# Altium project Breakout Board.PrjPcb
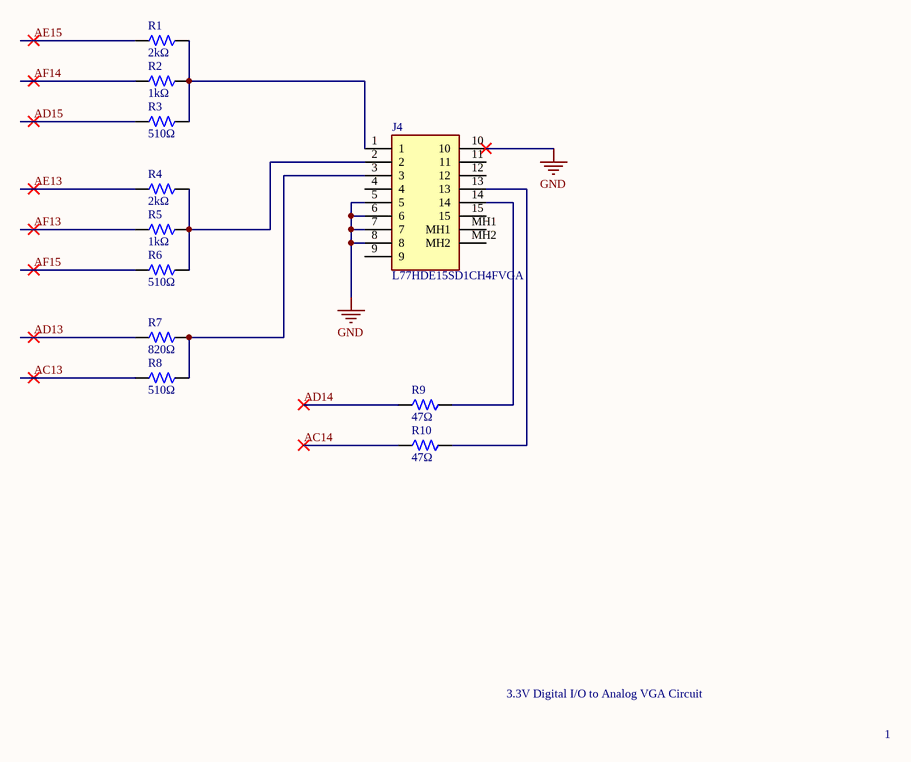
[diagram p0: VGA.SchDoc]
6 sheets, 96 parts. Net scope: flat (ports and power ports of the same name join across sheets).
Board files: PCB1.PcbDoc, revision2.PcbDoc
Sheets:
  VGA.SchDoc
  FPGA_GPIO.SchDoc
  MICROSD.SchDoc
  SWITCHES.SchDoc
  BOARD_GPIO.SchDoc
  HDMI.SchDoc

## Sheet VGA.SchDoc
size A; SheetNumber: 1; SheetTotal: 5

### Parts
J4  L77HDE15SD1CH4FVGA  [L77HDE15SD1CH4FVGA]
R1  Resistance: 2kΩ  [RES-0402]  (hidden comment: 0402WGF2001TCE)
R2  Resistance: 1kΩ  [RES-0402]  (hidden comment: 0402WGF1001TCE)
R3  Resistance: 510Ω  [RES-0402]  (hidden comment: 0402WGF5100TCE)
R4  Resistance: 2kΩ  [RES-0402]  (hidden comment: 0402WGF2001TCE)
R5  Resistance: 1kΩ  [RES-0402]  (hidden comment: 0402WGF1001TCE)
R6  Resistance: 510Ω  [RES-0402]  (hidden comment: 0402WGF5100TCE)
R7  Resistance: 820Ω  [RES-0603]  (hidden comment: 0603WAF8200T5E)
R8  Resistance: 510Ω  [RES-0402]  (hidden comment: 0402WGF5100TCE)
R9  Resistance: 47Ω  [RES-0603]  (hidden comment: 0603WAF470JT5E)
R10  Resistance: 47Ω  [RES-0603]  (hidden comment: 0603WAF470JT5E)

### Nets
GND: J4.5 J4.6 J4.7 J4.8 J4.10  [project net DDCSDA]
AC13: R8.1
AC14: R10.1
AD13: R7.1
AD14: R9.1
AD15: R3.1
AE13: R4.1
AE15: R1.1
AF13: R5.1
AF14: R2.1
AF15: R6.1
NetJ4_1: J4.1 R1.2 R2.2 R3.2
NetJ4_2: J4.2 R4.2 R5.2 R6.2
NetJ4_3: J4.3 R7.2 R8.2
NetJ4_13: J4.13 R10.2
NetJ4_14: J4.14 R9.2

Not connected (* = marked no-connect by the designer): J4 4 9 11 12 15 MH1 MH2

### Notes on the sheet
- 3.3V Digital I/O to Analog VGA Circuit
- 1

### Library data of the parts
J4 = L77HDE15SD1CH4FVGA: Connector; Manufacturer_Name: Amphenol Communications Solutions; Datasheet Link: https://cdn.amphenol-cs.com/media/wysiwyg/files/drawing/l77hde15sd1ch4fvga.pdf; Height: 12.85mm; Manufacturer_Part_Number: L77HDE15SD1CH4FVGA; Mouser Part Number: 523-7HDE15SD1CH4FVGA; Mouser Price/Stock: https://www.mouser.co.uk/ProductDetail/Amphenol-Commercial-Products/L77HDE15SD1CH4FVGA?qs=ToP8pWlZ0bNtQSp9f8k5Rw%3D%3D; Arrow Part Number: L77HDE15SD1CH4FVGA; Arrow Price/Stock: https://www.arrow.com/en/products/l77hde15sd1ch4fvga/amphenol-fci?region=nac
R1 R4 = 0402WGF2001TCE: Resistor, 2kΩ, ±1%, 62.5mW, 50V, ±100ppm/℃, -55℃~+155℃, SMD 0402; Manufacturer: Uniroyal; Supplier 1: LCSC; Manufacturer Part Number: 0402WGF2001TCE; Supplier Part Number 1: C4109; JLCPCB Part Number: C4109; Power Rating: 62.5mW; Category: Resistors; Package Size: 0402; JLCPCB Basic Part: Yes; Tolerance: ±1%; Voltage Rating: 50V; Temperature Coefficient: ±100ppm/℃; Temperature Rating: -55℃~+155℃; ComponentLink1Description: Datasheet; ComponentLink1URL: https://wmsc.lcsc.com/wmsc/upload/file/pdf/v2/lcsc/2206010230_UNI-ROYAL-Uniroyal-Elec-0402WGF2001TCE_C4109.pdf; ComponentLink2Description: JLCPCB Part URL; ComponentLink2URL: https://jlcpcb.com/partdetail/C4109
R2 R5 = 0402WGF1001TCE: Resistor, 1kΩ, ±1%, 62.5mW, 50V, ±100ppm/℃, -55℃~+155℃, SMD 0402; Manufacturer: Uniroyal; Supplier 1: LCSC; Manufacturer Part Number: 0402WGF1001TCE; Supplier Part Number 1: C11702; JLCPCB Part Number: C11702; Power Rating: 62.5mW; Category: Resistors; Package Size: 0402; JLCPCB Basic Part: Yes; Tolerance: ±1%; Voltage Rating: 50V; Temperature Coefficient: ±100ppm/℃; Temperature Rating: -55℃~+155℃; ComponentLink1Description: Datasheet; ComponentLink1URL: https://wmsc.lcsc.com/wmsc/upload/file/pdf/v2/lcsc/2206010216_UNI-ROYAL-Uniroyal-Elec-0402WGF1001TCE_C11702.pdf; ComponentLink2Description: JLCPCB Part URL; ComponentLink2URL: https://jlcpcb.com/partdetail/C11702
R3 R6 R8 = 0402WGF5100TCE: Resistor, 510Ω, ±1%, 62.5mW, 50V, ±100ppm/℃, -55℃~+155℃, SMD 0402; Manufacturer: Uniroyal; Supplier 1: LCSC; Manufacturer Part Number: 0402WGF5100TCE; Supplier Part Number 1: C25123; JLCPCB Part Number: C25123; Power Rating: 62.5mW; Category: Resistors; Package Size: 0402; JLCPCB Basic Part: Yes; Tolerance: ±1%; Voltage Rating: 50V; Temperature Coefficient: ±100ppm/℃; Temperature Rating: -55℃~+155℃; ComponentLink1Description: Datasheet; ComponentLink1URL: https://wmsc.lcsc.com/wmsc/upload/file/pdf/v2/lcsc/2205311900_UNI-ROYAL-Uniroyal-Elec-0402WGF5100TCE_C25123.pdf; ComponentLink2Description: JLCPCB Part URL; ComponentLink2URL: https://jlcpcb.com/partdetail/C25123
R7 = 0603WAF8200T5E: Resistor, 820Ω, ±1%, 100mW, 75V, ±100ppm/℃, -55℃~+155℃, SMD 0603; Manufacturer: Uniroyal; Supplier 1: LCSC; Manufacturer Part Number: 0603WAF8200T5E; Supplier Part Number 1: C23253; JLCPCB Part Number: C23253; Power Rating: 100mW; Category: Resistors; Package Size: 0603; JLCPCB Basic Part: Yes; Tolerance: ±1%; Voltage Rating: 75V; Temperature Coefficient: ±100ppm/℃; Temperature Rating: -55℃~+155℃; ComponentLink1Description: Datasheet; ComponentLink1URL: https://wmsc.lcsc.com/wmsc/upload/file/pdf/v2/lcsc/2206010100_UNI-ROYAL-Uniroyal-Elec-0603WAF8200T5E_C23253.pdf; ComponentLink2Description: JLCPCB Part URL; ComponentLink2URL: https://jlcpcb.com/partdetail/C23253
R9 R10 = 0603WAF470JT5E: Resistor, 47Ω, ±1%, 100mW, 75V, ±100ppm/℃, -55℃~+155℃, SMD 0603; Manufacturer: Uniroyal; Supplier 1: LCSC; Manufacturer Part Number: 0603WAF470JT5E; Supplier Part Number 1: C23182; JLCPCB Part Number: C23182; Power Rating: 100mW; Category: Resistors; Package Size: 0603; JLCPCB Basic Part: Yes; Tolerance: ±1%; Voltage Rating: 75V; Temperature Coefficient: ±100ppm/℃; Temperature Rating: -55℃~+155℃; ComponentLink1Description: Datasheet; ComponentLink1URL: https://wmsc.lcsc.com/wmsc/upload/file/pdf/v2/lcsc/2206010116_UNI-ROYAL-Uniroyal-Elec-0603WAF470JT5E_C23182.pdf; ComponentLink2Description: JLCPCB Part URL; ComponentLink2URL: https://jlcpcb.com/partdetail/C23182

## Sheet FPGA_GPIO.SchDoc
size A; SheetNumber: 2; SheetTotal: 5; Application_BuildNumber: 1
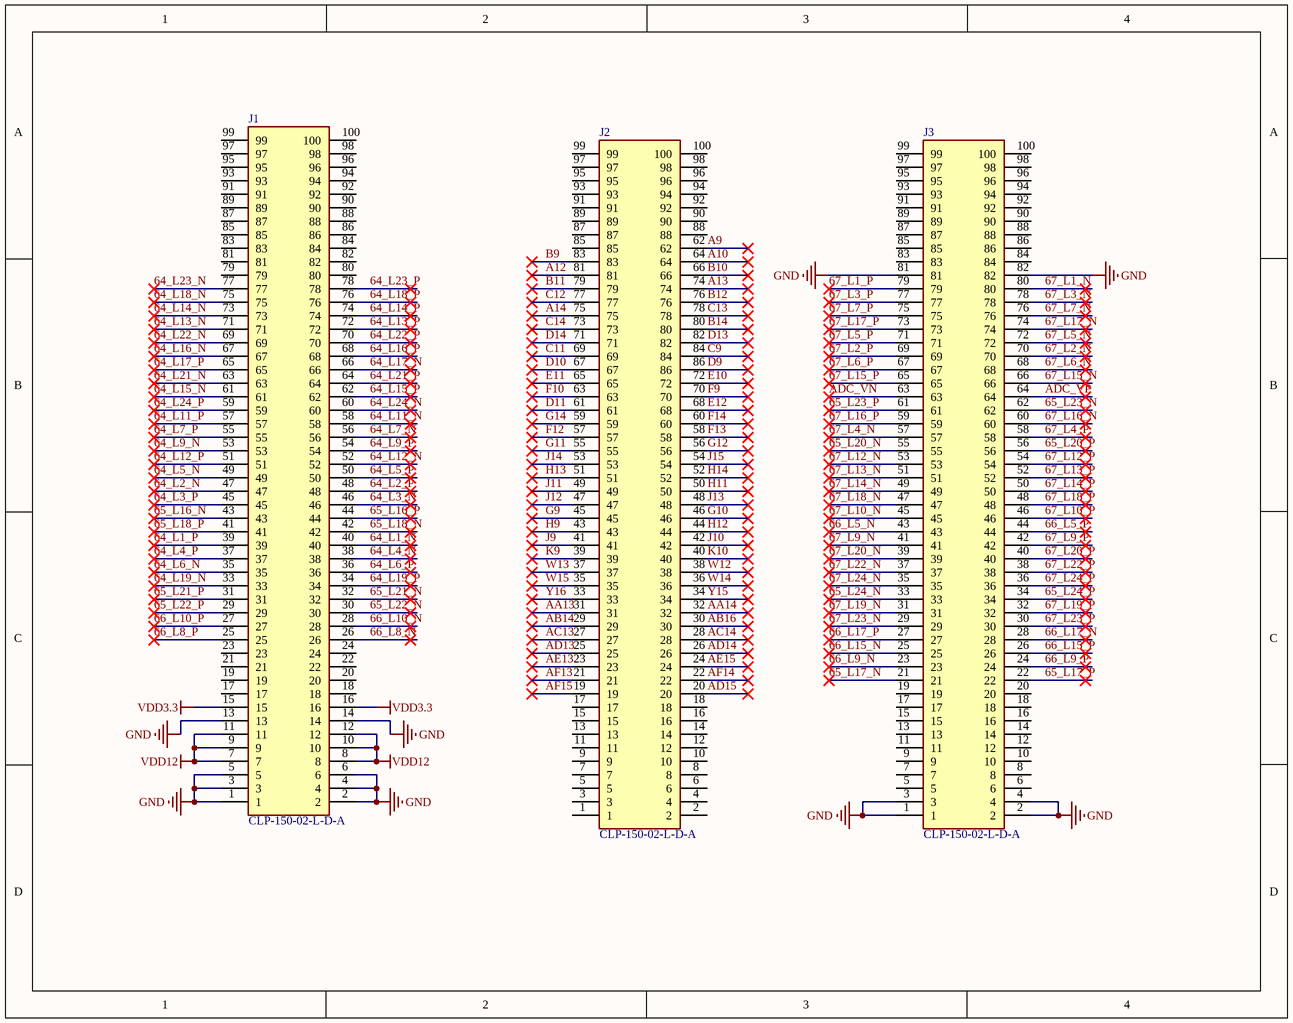
[diagram p1: FPGA_GPIO.SchDoc]

### Parts
J1  CLP-150-02-L-D-A  [CLP-150-02-XXX-D-A]  (no BOM)
J2  CLP-150-02-L-D-A  [CLP-150-02-XXX-D-A]  (no BOM)
J3  CLP-150-02-L-D-A  [CLP-150-02-XXX-D-A]  (no BOM)

### Nets
GND: J1.1 J1.2 J1.3 J1.4 J1.5 J1.6 J1.13 J1.14 J3.1 J3.2 J3.3 J3.4 J3.81 J3.82  [project net DDCSDA]
VDD3.3: J1.15 J1.16
VDD12: J1.7 J1.8 J1.9 J1.10 J1.11 J1.12
64_L1_N: J1.40
64_L1_P: J1.39
64_L2_N: J1.47
64_L2_P: J1.48
64_L3_N: J1.46
64_L3_P: J1.45
64_L4_N: J1.38
64_L4_P: J1.37
64_L5_N: J1.49
64_L5_P: J1.50
64_L6_N: J1.35
64_L6_P: J1.36
64_L7_N: J1.56
64_L7_P: J1.55
64_L9_N: J1.53
64_L9_P: J1.54
64_L11_N: J1.58
64_L11_P: J1.57
64_L12_N: J1.52
64_L12_P: J1.51
64_L13_N: J1.71
64_L13_P: J1.72
64_L14_N: J1.73
64_L14_P: J1.74
64_L15_N: J1.61
64_L15_P: J1.62
64_L16_N: J1.67
64_L16_P: J1.68
64_L17_N: J1.66
64_L17_P: J1.65
64_L18_N: J1.75
64_L18_P: J1.76
64_L19_N: J1.33
64_L19_P: J1.34
64_L21_N: J1.63
64_L21_P: J1.64
64_L22_N: J1.69
64_L22_P: J1.70
64_L23_N: J1.77
64_L23_P: J1.78
64_L24_N: J1.60
64_L24_P: J1.59
65_L16_N: J1.43
65_L16_P: J1.44
65_L17_N: J3.21
65_L17_P: J3.22
65_L18_N: J1.42
65_L18_P: J1.41
65_L20_N: J3.55
65_L20_P: J3.56
65_L21_N: J1.32
65_L21_P: J1.31
65_L22_N: J1.30
65_L22_P: J1.29
65_L23_N: J3.62
65_L23_P: J3.61
65_L24_N: J3.33
65_L24_P: J3.34
66_L5_N: J3.43
66_L5_P: J3.44
66_L8_N: J1.26
66_L8_P: J1.25
66_L9_N: J3.23
66_L9_P: J3.24
66_L10_N: J1.28
66_L10_P: J1.27
66_L15_N: J3.25
66_L15_P: J3.26
66_L17_N: J3.28
66_L17_P: J3.27
67_L1_N: J3.80
67_L1_P: J3.79
67_L2_N: J3.70
67_L2_P: J3.69
67_L3_N: J3.78
67_L3_P: J3.77
67_L4_N: J3.57
67_L4_P: J3.58
67_L5_N: J3.72
67_L5_P: J3.71
67_L6_N: J3.68
67_L6_P: J3.67
67_L7_N: J3.76
67_L7_P: J3.75
67_L9_N: J3.41
67_L9_P: J3.42
67_L10_N: J3.45
67_L10_P: J3.46
67_L12_N: J3.53
67_L12_P: J3.54
67_L13_N: J3.51
67_L13_P: J3.52
67_L14_N: J3.49
67_L14_P: J3.50
67_L15_N: J3.66
67_L15_P: J3.65
67_L16_N: J3.60
67_L16_P: J3.59
67_L17_N: J3.74
67_L17_P: J3.73
67_L18_N: J3.47
67_L18_P: J3.48
67_L19_N: J3.31
67_L19_P: J3.32
67_L20_N: J3.39
67_L20_P: J3.40
67_L22_N: J3.37
67_L22_P: J3.38
67_L23_N: J3.29
67_L23_P: J3.30
67_L24_N: J3.35
67_L24_P: J3.36
A9: J2.62
A10: J2.64
A12: J2.81
A13: J2.74
A14: J2.75
AA13: J2.31
AA14: J2.32
AB14: J2.29
AB16: J2.30
AC13: J2.27
AC14: J2.28
AD13: J2.25
AD14: J2.26
AD15: J2.20
ADC_VN: J3.63
ADC_VP: J3.64
AE13: J2.23
AE15: J2.24
AF13: J2.21
AF14: J2.22
AF15: J2.19
B9: J2.83
B10: J2.66
B11: J2.79
B12: J2.76
B14: J2.80
C9: J2.84
C11: J2.69
C12: J2.77
C13: J2.78
C14: J2.73
D9: J2.86
D10: J2.67
D11: J2.61
D13: J2.82
D14: J2.71
E10: J2.72
E11: J2.65
E12: J2.68
F9: J2.70
F10: J2.63
F12: J2.57
F13: J2.58
F14: J2.60
G9: J2.45
G10: J2.46
G11: J2.55
G12: J2.56
G14: J2.59
H9: J2.43
H11: J2.50
H12: J2.44
H13: J2.51
H14: J2.52
J9: J2.41
J10: J2.42
J11: J2.49
J12: J2.47
J13: J2.48
J14: J2.53
J15: J2.54
K9: J2.39
K10: J2.40
W12: J2.38
W13: J2.37
W14: J2.36
W15: J2.35
Y15: J2.34
Y16: J2.33

Not connected (* = marked no-connect by the designer): J1 17 18 19 20 21 22 23 24 79 80 81 82 83 84 85 86 87 88 89 90 91 92 93 94 95 96 97 98 99 100; J2 1 2 3 4 5 6 7 8 9 10 11 12 13 14 15 16 17 18 85 87 88 89 90 91 92 93 94 95 96 97 98 99 100; J3 5 6 7 8 9 10 11 12 13 14 15 16 17 18 19 20 83 84 85 86 87 88 89 90 91 92 93 94 95 96 97 98 99 100

### Library data of the parts
J1-J3 = CLP-150-02-L-D-A: Connector; Manufacturer_Name: SAMTEC; Datasheet Link: http://suddendocs.samtec.com/prints/erm8-xxx-xx.x-xxx-dv-xxxx-xx-mkt.pdf; Height: 2.37mm; Manufacturer_Part_Number: CLP-150-02-L-D-A
  J2: Parameter 1: *

## Sheet MICROSD.SchDoc
size D; SheetNumber: 3; SheetTotal: 6
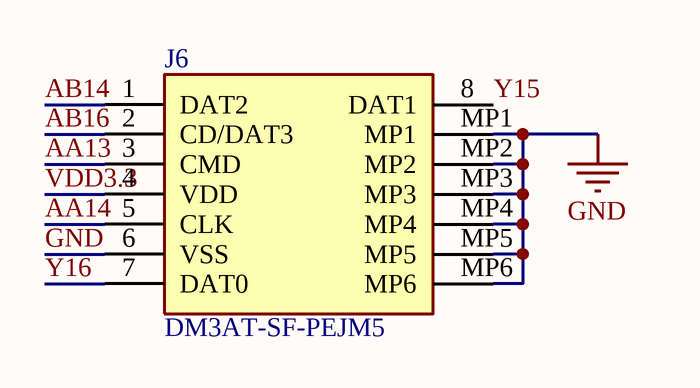
[diagram p2: MICROSD.SchDoc]

### Parts
J6  DM3AT-SF-PEJM5  [DM3ATSFPEJM5]

### Nets
GND: J6.6(VSS) J6.MP1 J6.MP2 J6.MP3 J6.MP4 J6.MP5 J6.MP6  [project net DDCSDA]
AA13: J6.3(CMD)
AA14: J6.5(CLK)
AB14: J6.1(DAT2)
AB16: J6.2(CD/DAT3)
VDD3.3: J6.4(VDD)
Y15: J6.8(DAT1)
Y16: J6.7(DAT0)

### Library data of the parts
J6 = DM3AT-SF-PEJM5: Connector; Manufacturer_Name: Hirose; Datasheet Link: https://datasheet.lcsc.com/szlcsc/Hirose-HRS-DM3AT-SF-PEJM5_C114218.pdf; Height: 1.83mm; Manufacturer_Part_Number: DM3AT-SF-PEJM5; Mouser Part Number: 798-DM3AT-SF-PEJM5; Mouser Price/Stock: https://www.mouser.co.uk/ProductDetail/Hirose-Connector/DM3AT-SF-PEJM5?qs=LZSZKJVF%252B2WTDKp%252BR7IYAQ%3D%3D

## Sheet SWITCHES.SchDoc
size D; SheetNumber: 4; SheetTotal: 5
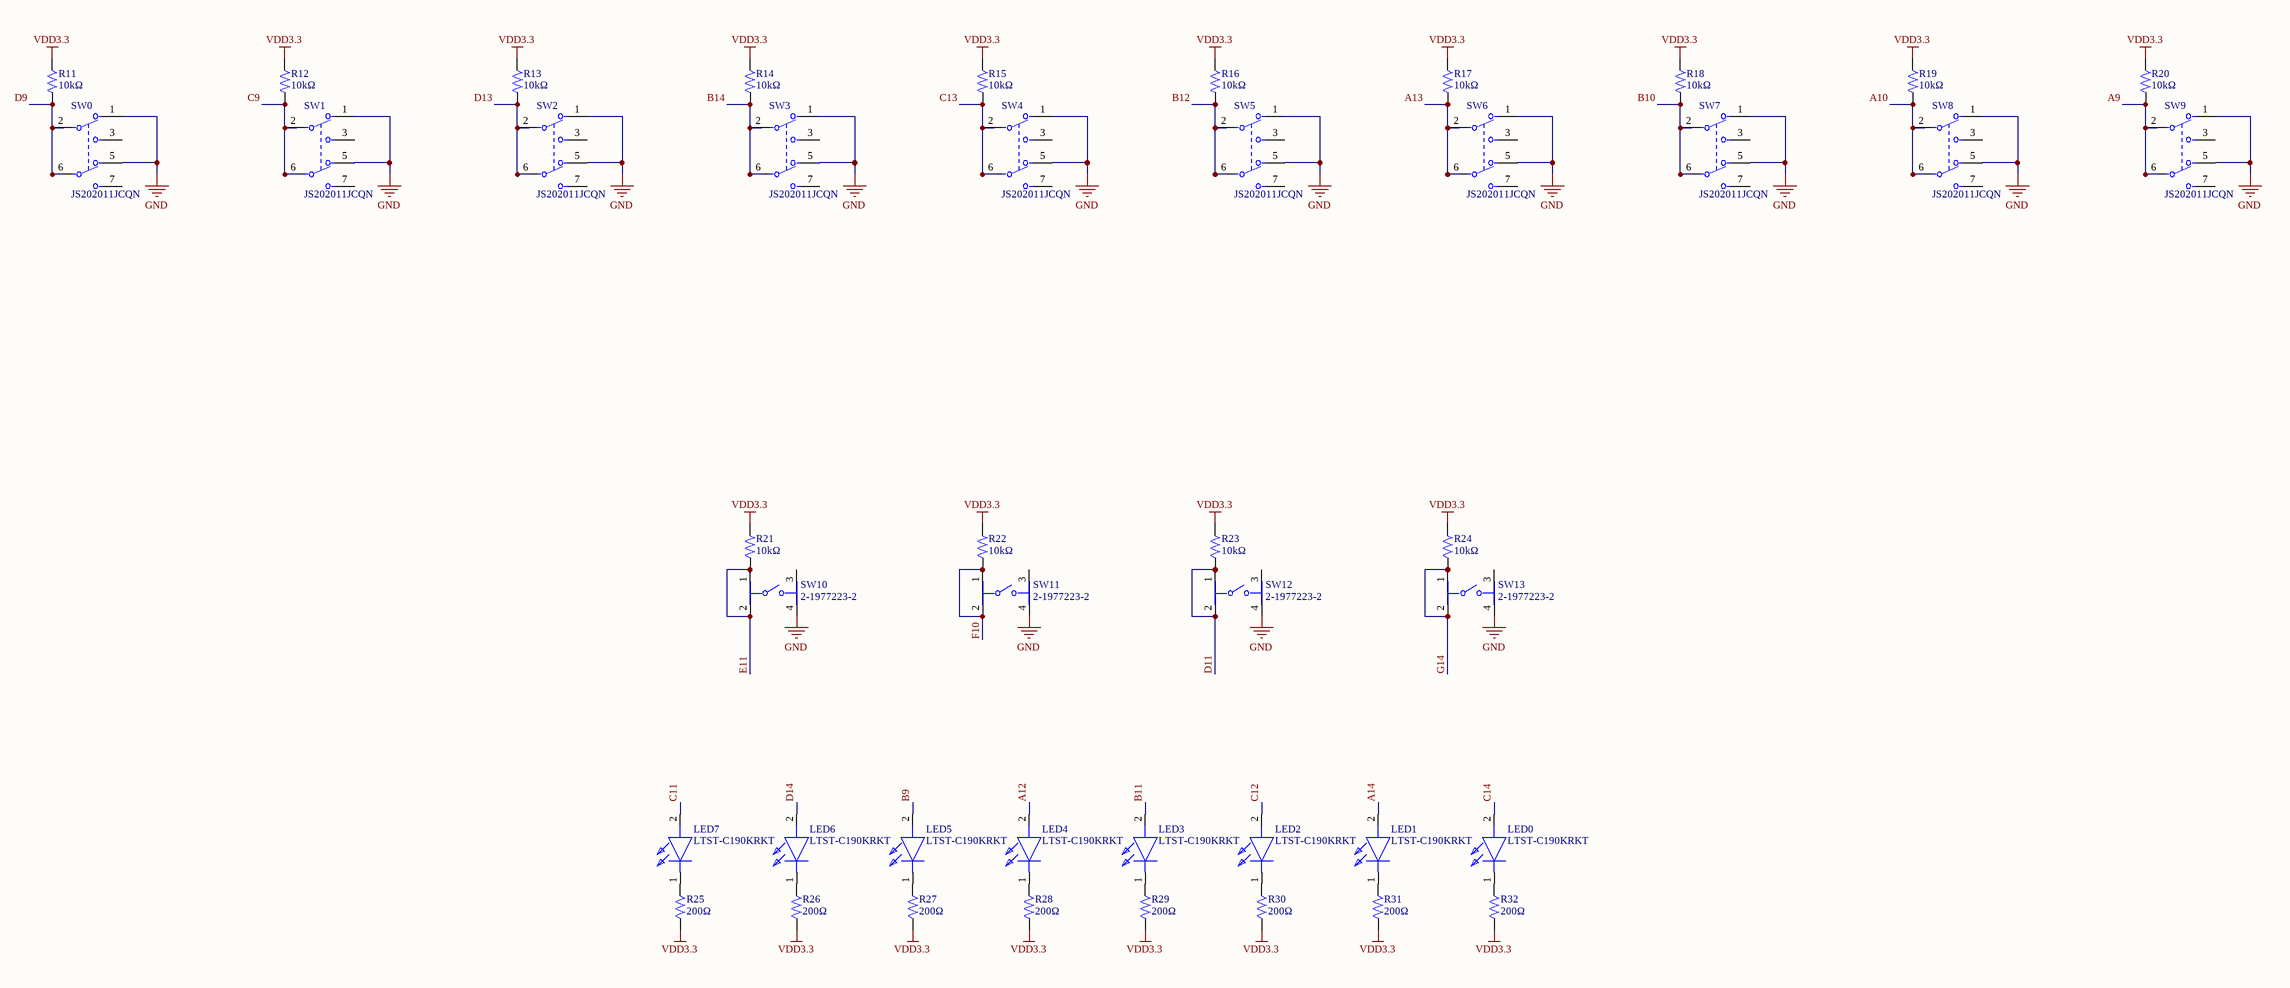
[diagram p3: SWITCHES.SchDoc]

### Parts
LED0  LTST-C190KRKT  [LEDC1608X80N]
LED1  LTST-C190KRKT  [LEDC1608X80N]
LED2  LTST-C190KRKT  [LEDC1608X80N]
LED3  LTST-C190KRKT  [LEDC1608X80N]
LED4  LTST-C190KRKT  [LEDC1608X80N]
LED5  LTST-C190KRKT  [LEDC1608X80N]
LED6  LTST-C190KRKT  [LEDC1608X80N]
LED7  LTST-C190KRKT  [LEDC1608X80N]
R11  Resistance: 10kΩ  [RES-0603]  (hidden comment: 0603WAF1002T5E)
R12  Resistance: 10kΩ  [RES-0603]  (hidden comment: 0603WAF1002T5E)
R13  Resistance: 10kΩ  [RES-0603]  (hidden comment: 0603WAF1002T5E)
R14  Resistance: 10kΩ  [RES-0603]  (hidden comment: 0603WAF1002T5E)
R15  Resistance: 10kΩ  [RES-0603]  (hidden comment: 0603WAF1002T5E)
R16  Resistance: 10kΩ  [RES-0603]  (hidden comment: 0603WAF1002T5E)
R17  Resistance: 10kΩ  [RES-0603]  (hidden comment: 0603WAF1002T5E)
R18  Resistance: 10kΩ  [RES-0603]  (hidden comment: 0603WAF1002T5E)
R19  Resistance: 10kΩ  [RES-0603]  (hidden comment: 0603WAF1002T5E)
R20  Resistance: 10kΩ  [RES-0603]  (hidden comment: 0603WAF1002T5E)
R21  Resistance: 10kΩ  [RES-0603]  (hidden comment: 0603WAF1002T5E)
R22  Resistance: 10kΩ  [RES-0603]  (hidden comment: 0603WAF1002T5E)
R23  Resistance: 10kΩ  [RES-0603]  (hidden comment: 0603WAF1002T5E)
R24  Resistance: 10kΩ  [RES-0603]  (hidden comment: 0603WAF1002T5E)
R25  Resistance: 200Ω  [RES-0402]  (hidden comment: 0402WGF2000TCE)
R26  Resistance: 200Ω  [RES-0402]  (hidden comment: 0402WGF2000TCE)
R27  Resistance: 200Ω  [RES-0402]  (hidden comment: 0402WGF2000TCE)
R28  Resistance: 200Ω  [RES-0402]  (hidden comment: 0402WGF2000TCE)
R29  Resistance: 200Ω  [RES-0402]  (hidden comment: 0402WGF2000TCE)
R30  Resistance: 200Ω  [RES-0402]  (hidden comment: 0402WGF2000TCE)
R31  Resistance: 200Ω  [RES-0402]  (hidden comment: 0402WGF2000TCE)
R32  Resistance: 200Ω  [RES-0402]  (hidden comment: 0402WGF2000TCE)
SW0  JS202011JCQN  [FP-JS202011JCQN-MFG]
SW1  JS202011JCQN  [FP-JS202011JCQN-MFG]
SW2  JS202011JCQN  [FP-JS202011JCQN-MFG]
SW3  JS202011JCQN  [FP-JS202011JCQN-MFG]
SW4  JS202011JCQN  [FP-JS202011JCQN-MFG]
SW5  JS202011JCQN  [FP-JS202011JCQN-MFG]
SW6  JS202011JCQN  [FP-JS202011JCQN-MFG]
SW7  JS202011JCQN  [FP-JS202011JCQN-MFG]
SW8  JS202011JCQN  [FP-JS202011JCQN-MFG]
SW9  JS202011JCQN  [FP-JS202011JCQN-MFG]
SW10  2-1977223-2  [FP-2-1977223-2-MFG]
SW11  2-1977223-2  [FP-2-1977223-2-MFG]
SW12  2-1977223-2  [FP-2-1977223-2-MFG]
SW13  2-1977223-2  [FP-2-1977223-2-MFG]

### Nets
GND: SW0.1 SW0.5 SW1.1 SW1.5 SW2.1 SW2.5 SW3.1 SW3.5 SW4.1 SW4.5 SW5.1 SW5.5 SW6.1 SW6.5 SW7.1 SW7.5 SW8.1 SW8.5 SW9.1 SW9.5 SW10.4 SW11.4 SW12.4 SW13.4  [project net DDCSDA]
VDD3.3: R11.2 R12.2 R13.2 R14.2 R15.2 R16.2 R17.2 R18.2 R19.2 R20.2 R21.2 R22.2 R23.2 R24.2 R25.1 R26.1 R27.1 R28.1 R29.1 R30.1 R31.1 R32.1
A9: R20.1 SW9.2(1_C) SW9.6(2_C)
A10: R19.1 SW8.2(1_C) SW8.6(2_C)
A12: LED4.2(A)
A13: R17.1 SW6.2(1_C) SW6.6(2_C)
A14: LED1.2(A)
B9: LED5.2(A)
B10: R18.1 SW7.2(1_C) SW7.6(2_C)
B11: LED3.2(A)
B12: R16.1 SW5.2(1_C) SW5.6(2_C)
B14: R14.1 SW3.2(1_C) SW3.6(2_C)
C9: R12.1 SW1.2(1_C) SW1.6(2_C)
C11: LED7.2(A)
C12: LED2.2(A)
C13: R15.1 SW4.2(1_C) SW4.6(2_C)
C14: LED0.2(A)
D9: R11.1 SW0.2(1_C) SW0.6(2_C)
D11: R23.1 SW12.1 SW12.2
D13: R13.1 SW2.2(1_C) SW2.6(2_C)
D14: LED6.2(A)
E11: R21.1 SW10.1 SW10.2
F10: R22.1 SW11.1 SW11.2
G14: R24.1 SW13.1 SW13.2
NetLED0_1: LED0.1(K) R32.2
NetLED1_1: LED1.1(K) R31.2
NetLED2_1: LED2.1(K) R30.2
NetLED3_1: LED3.1(K) R29.2
NetLED4_1: LED4.1(K) R28.2
NetLED5_1: LED5.1(K) R27.2
NetLED6_1: LED6.1(K) R26.2
NetLED7_1: LED7.1(K) R25.2

Not connected (* = marked no-connect by the designer): SW0 3 7; SW1 3 7; SW2 3 7; SW3 3 7; SW4 3 7; SW5 3 7; SW6 3 7; SW7 3 7; SW8 3 7; SW9 3 7; SW10 3; SW11 3; SW12 3; SW13 3

### Library data of the parts
LED0-LED7 = LTST-C190KRKT: LED; Manufacturer_Name: Lite-On; Datasheet Link: https://componentsearchengine.com/Datasheets/1/LTST-C190KRKT.pdf; Height: 0.8mm; Manufacturer_Part_Number: LTST-C190KRKT; Mouser Part Number: 859-LTST-C190KRKT; Mouser Price/Stock: https://www.mouser.co.uk/ProductDetail/LITEON/LTST-C190KRKT?qs=kAD5fFa1n5VY3YYNWPC1Fg%3D%3D; Arrow Part Number: LTST-C190KRKT; Arrow Price/Stock: https://www.arrow.com/en/products/ltst-c190krkt/lite-on-technology?utm_currency=USD&region=europe
R11-R24 = 0603WAF1002T5E: Resistor, 10kΩ, ±1%, 100mW, 75V, ±100ppm/℃, -55℃~+155℃, SMD 0603; Manufacturer: Uniroyal; Supplier 1: LCSC; Manufacturer Part Number: 0603WAF1002T5E; Supplier Part Number 1: C25804; JLCPCB Part Number: C25804; Power Rating: 100mW; Category: Resistors; Package Size: 0603; JLCPCB Basic Part: Yes; Tolerance: ±1%; Voltage Rating: 75V; Temperature Coefficient: ±100ppm/℃; Temperature Rating: -55℃~+155℃; ComponentLink1Description: Datasheet; ComponentLink1URL: https://wmsc.lcsc.com/wmsc/upload/file/pdf/v2/lcsc/2206010045_UNI-ROYAL-Uniroyal-Elec-0603WAF1002T5E_C25804.pdf; ComponentLink2Description: JLCPCB Part URL; ComponentLink2URL: https://jlcpcb.com/partdetail/C25804
R25-R32 = 0402WGF2000TCE: Resistor, 200Ω, ±1%, 62.5mW, 50V, ±100ppm/℃, -55℃~+155℃, SMD 0402; Manufacturer: Uniroyal; Supplier 1: LCSC; Manufacturer Part Number: 0402WGF2000TCE; Supplier Part Number 1: C25087; JLCPCB Part Number: C25087; Power Rating: 62.5mW; Category: Resistors; Package Size: 0402; JLCPCB Basic Part: Yes; Tolerance: ±1%; Voltage Rating: 50V; Temperature Coefficient: ±100ppm/℃; Temperature Rating: -55℃~+155℃; ComponentLink1Description: Datasheet; ComponentLink1URL: https://wmsc.lcsc.com/wmsc/upload/file/pdf/v2/lcsc/2205311900_UNI-ROYAL-Uniroyal-Elec-0402WGF2000TCE_C25087.pdf; ComponentLink2Description: JLCPCB Part URL; ComponentLink2URL: https://jlcpcb.com/partdetail/C25087
SW0-SW9 = CMP-10038-000009-1: SWITCH SLIDE DPDT 300MA 6V; Actuator Material: Nylon; Actuator Length: 2mm; Actuator Type: Standard; Electrical Life: 5000Cycles; Switch Function: On-On; Mount: Surface Mount; Current Rating: 300mA; Contact Material: Copper Alloy; Voltage Rating (DC): 6V; Throw Configuration: DPDT; Packaging: Cut Tape; Contact Plating: Silver; Min Operating Temperature: -40°C; Switch Travel: 2mm; Max Operating Temperature: 85°C
SW10-SW13 = CMP-03407-000026-1: SWITCH TACTILE SPST-NO 0.05A 24V; RoHS Compliant: Yes

## Sheet BOARD_GPIO.SchDoc
size D; SheetNumber: 5; SheetTotal: 5
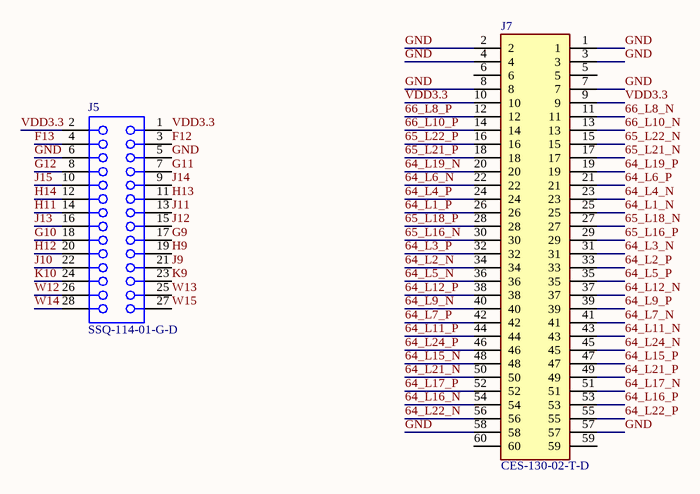
[diagram p4: BOARD_GPIO.SchDoc]

### Parts
J5  SSQ-114-01-G-D  [SMTC-SSQ-114-01-X-D]
J7  CES-130-02-T-D  [CES-130-XX-X-D]

### Nets
64_L1_N: J7.25
64_L1_P: J7.26
64_L2_N: J7.34
64_L2_P: J7.33
64_L3_N: J7.31
64_L3_P: J7.32
64_L4_N: J7.23
64_L4_P: J7.24
64_L5_N: J7.36
64_L5_P: J7.35
64_L6_N: J7.22
64_L6_P: J7.21
64_L7_N: J7.41
64_L7_P: J7.42
64_L9_N: J7.40
64_L9_P: J7.39
64_L11_N: J7.43
64_L11_P: J7.44
64_L12_N: J7.37
64_L12_P: J7.38
64_L15_N: J7.48
64_L15_P: J7.47
64_L16_N: J7.54
64_L16_P: J7.53
64_L17_N: J7.51
64_L17_P: J7.52
64_L19_N: J7.20
64_L19_P: J7.19
64_L21_N: J7.50
64_L21_P: J7.49
64_L22_N: J7.56
64_L22_P: J7.55
64_L24_N: J7.45
64_L24_P: J7.46
65_L16_N: J7.30
65_L16_P: J7.29
65_L18_N: J7.27
65_L18_P: J7.28
65_L21_N: J7.17
65_L21_P: J7.18
65_L22_N: J7.15
65_L22_P: J7.16
66_L8_N: J7.11
66_L8_P: J7.12
66_L10_N: J7.13
66_L10_P: J7.14
F12: J5.3
F13: J5.4
G9: J5.17
G10: J5.18
G11: J5.7
G12: J5.8
GND: J5.5 J5.6 J7.1 J7.2 J7.3 J7.4 J7.7 J7.8 J7.57 J7.58
H9: J5.19
H11: J5.14
H12: J5.20
H13: J5.11
H14: J5.12
J9: J5.21
J10: J5.22
J11: J5.13
J12: J5.15
J13: J5.16
J14: J5.9
J15: J5.10
K9: J5.23
K10: J5.24
VDD3.3: J5.1 J5.2 J7.9 J7.10
W12: J5.26
W13: J5.25
W14: J5.28
W15: J5.27

Not connected (* = marked no-connect by the designer): J7 5 6 59 60

### Library data of the parts
J5 = CMP-1023-00305-1: SQ Post Socket, Through-hole, Vertical, -55 to 125 degC, 2.54 mm Pitch, 28-Pin, Female, RoHS; Manufacturer: Samtec; Pitch: 2.54 mm; Temperature Range: -55 to 125 degC; Mounting Technology: Through-hole; ComponentLink1URL: http://www.samtec.com; PackageDescription: Assembly, Socket Strip .025[0.64] SQ Tail; Orientation: Vertical; RoHS: True; ComponentLink3URL: http://www.samtec.com/documents/webfiles/cpdf/SSQ-1XX-XX-XXX-X-XX-XXX-XX-X-MKT.pdf; ComponentLink2URL: http://www.samtec.com/documents/webfiles/pdf/SSQ_TH.PDF; ComponentLink1Description: Manufacturer URL; PackageReference: SSQ-114-01-X-D; DatasheetVersion: F-214; ComponentLink3Description: Package Specification; ComponentLink2Description: Datasheet; PartNumber: SSQ-114-01-G-D; PackageVersion: BD, 6/1987
J7 = CES-130-02-T-D: Connector; Manufacturer_Name: SAMTEC; Datasheet Link: http://suddendocs.samtec.com/prints/ces-1xx-xx-x-d%20-mkt.pdf; Manufacturer_Part_Number: CES-130-02-T-D

## Sheet HDMI.SchDoc
size D; SheetNumber: 6; SheetTotal: 6
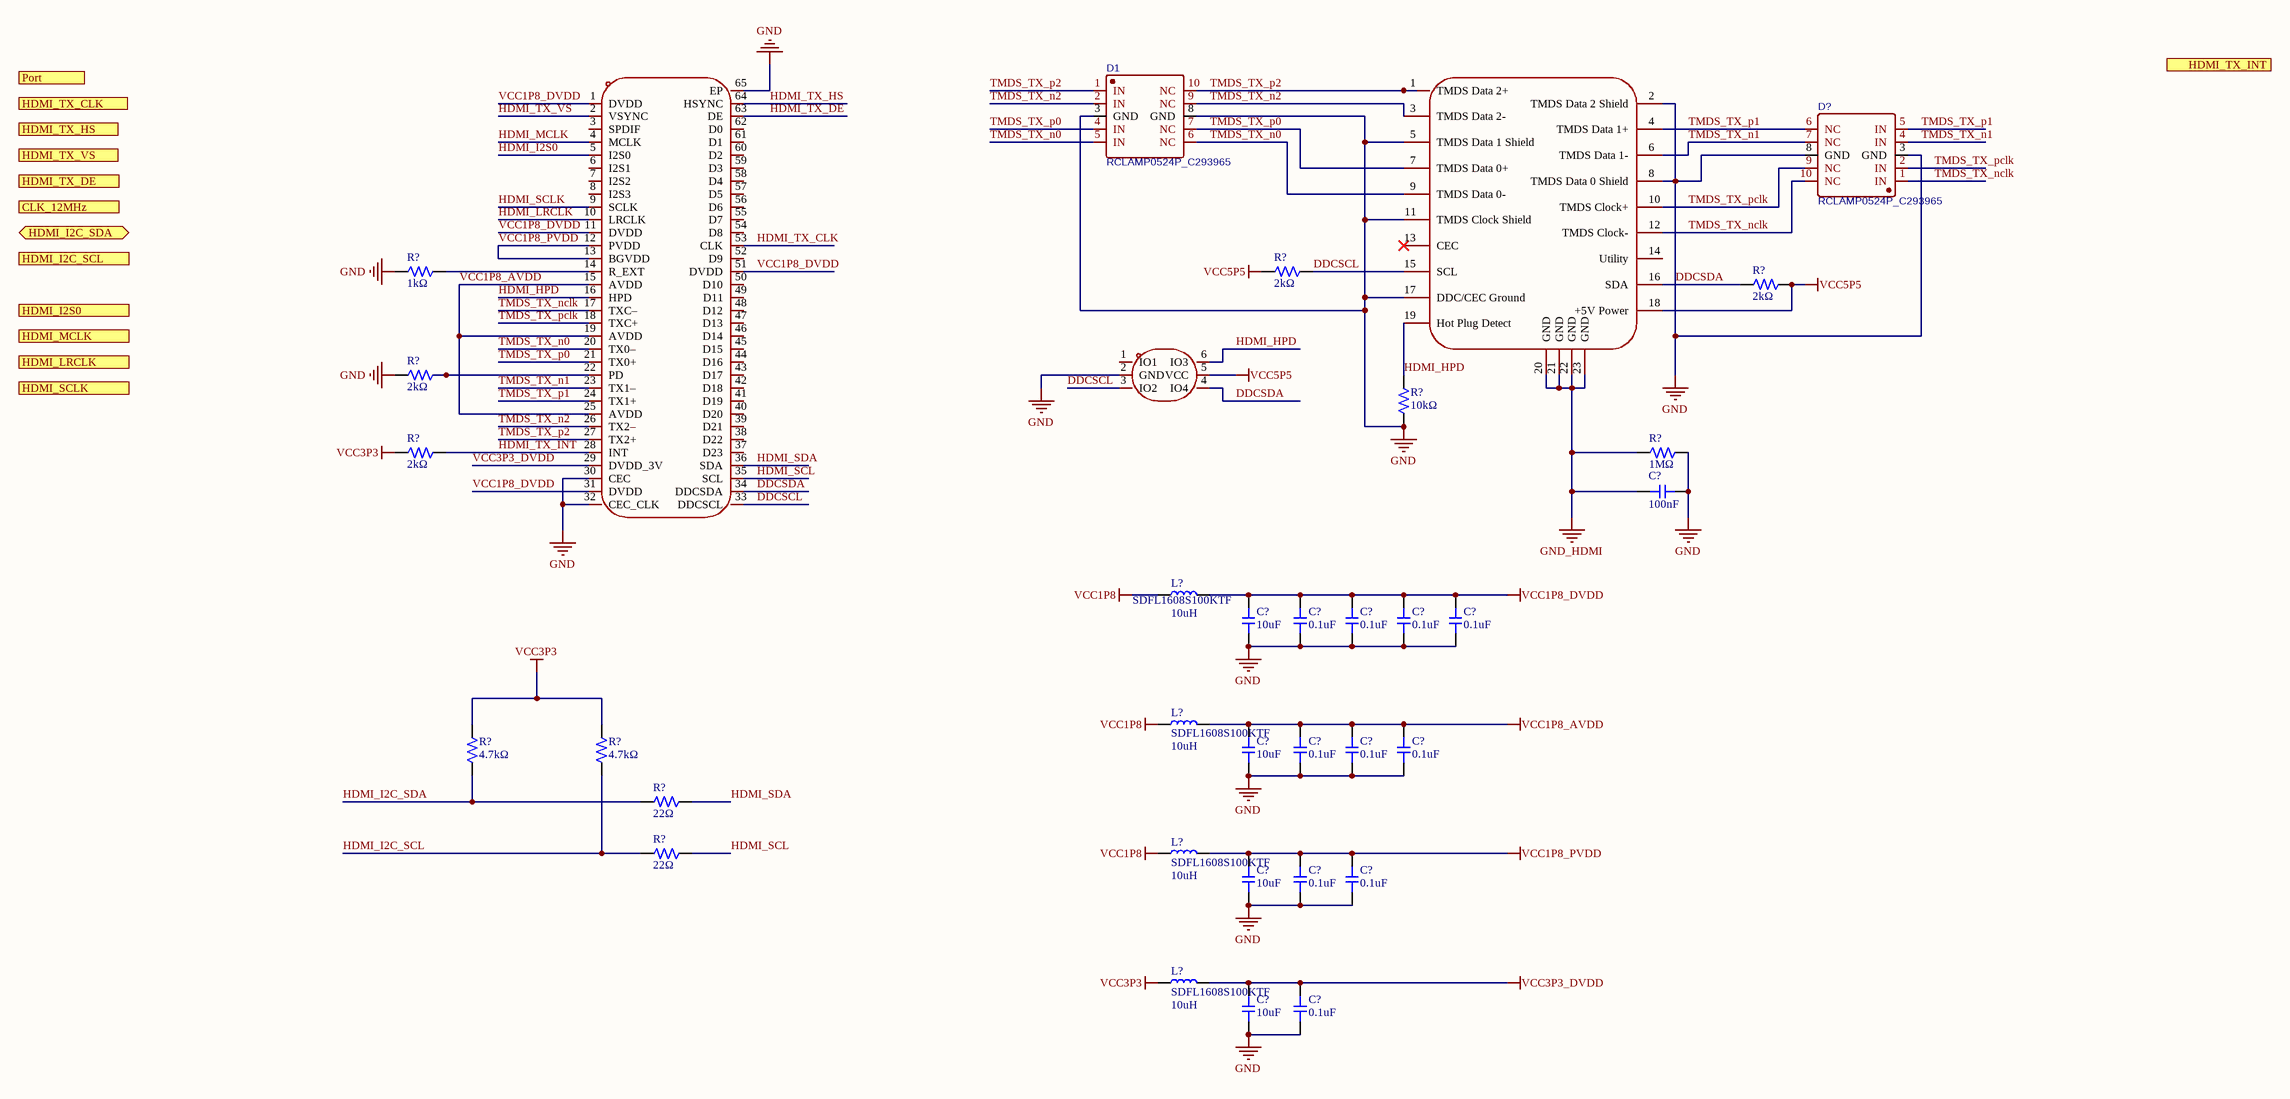
[diagram p5: HDMI.SchDoc]

### Parts
(Parts that share a designator on the sheet are numbered #1, #2 ... from top to bottom, then left to right.)
C?#1  Capacitance: 100nF  [CAP-0402]  (hidden comment: 0402B104M160)
C?#2  Capacitance: 10uF  [CAP-0402]  (hidden comment: 04026D106MAT2A)
C?#3  Capacitance: 0.1uF  (hidden comment: 02016D104KAT2A)
C?#4  Capacitance: 0.1uF  (hidden comment: 02016D104KAT2A)
C?#5  Capacitance: 0.1uF  (hidden comment: 02016D104KAT2A)
C?#6  Capacitance: 0.1uF  (hidden comment: 02016D104KAT2A)
C?#7  Capacitance: 10uF  [CAP-0402]  (hidden comment: 04026D106MAT2A)
C?#8  Capacitance: 0.1uF  (hidden comment: 02016D104KAT2A)
C?#9  Capacitance: 0.1uF  (hidden comment: 02016D104KAT2A)
C?#10  Capacitance: 0.1uF  (hidden comment: 02016D104KAT2A)
C?#11  Capacitance: 10uF  [CAP-0402]  (hidden comment: 04026D106MAT2A)
C?#12  Capacitance: 0.1uF  (hidden comment: 02016D104KAT2A)
C?#13  Capacitance: 0.1uF  (hidden comment: 02016D104KAT2A)
C?#14  Capacitance: 10uF  [CAP-0402]  (hidden comment: 04026D106MAT2A)
C?#15  Capacitance: 0.1uF  (hidden comment: 02016D104KAT2A)
D1  RCLAMP0524P_C293965  [DFN2510-10_L2.5-W1.0-P0.50-BL]
D?#1  RCLAMP0524P_C293965  [DFN2510-10_L2.5-W1.0-P0.50-BL]
D?#2  TPD4E001DBVR  [SOT-23-6_L2.9-W1.6-P0.95-LS2.8-BL]  (value not drawn)
L?#1  SDFL1608S100KTF  Inductance: 10uH  [IND-0603]
L?#2  SDFL1608S100KTF  Inductance: 10uH  [IND-0603]
L?#3  SDFL1608S100KTF  Inductance: 10uH  [IND-0603]
L?#4  SDFL1608S100KTF  Inductance: 10uH  [IND-0603]
R?#1  Resistance: 1kΩ  [RES-0402]  (hidden comment: 0402WGF1001TCE)
R?#2  Resistance: 2kΩ  [RES-0402]  (hidden comment: 0402WGF2001TCE)
R?#3  Resistance: 2kΩ  [RES-0402]  (hidden comment: 0402WGF2001TCE)
R?#4  Resistance: 2kΩ  [RES-0402]  (hidden comment: 0402WGF2001TCE)
R?#5  Resistance: 10kΩ  [RES-0603]  (hidden comment: 0603WAF1002T5E)
R?#6  Resistance: 2kΩ  [RES-0402]  (hidden comment: 0402WGF2001TCE)
R?#7  Resistance: 1MΩ  [RES-0402]  (hidden comment: 0402WGF1004TCE)
R?#8  Resistance: 4.7kΩ  [RES-0402]  (hidden comment: 0402WGF4701TCE)
R?#9  Resistance: 4.7kΩ  [RES-0402]  (hidden comment: 0402WGF4701TCE)
R?#10  Resistance: 22Ω  [RES-0402]  (hidden comment: 0402WGF220JTCE)
R?#11  Resistance: 22Ω  [RES-0402]  (hidden comment: 0402WGF220JTCE)
U?#1  HDMI-232D  [HDMI-232D]  (value not drawn)
U?#2  ADV7513BSWZ  [LQFP-64_L10.0-W10.0-P0.50-LS12.0-BL-EP5.3]  (value not drawn)

### Ports
CLK_12MHz (in), HDMI_I2C_SCL (in), HDMI_I2C_SDA (bidir), HDMI_I2S0 (in), HDMI_LRCLK (in), HDMI_MCLK (in), HDMI_SCLK (in), HDMI_TX_CLK (in), HDMI_TX_DE (in), HDMI_TX_HS (in), HDMI_TX_INT (out), HDMI_TX_VS (in), Port (in)

### Nets
DDCSDA: C?#1.2 C?#2.1 C?#3.1 C?#4.1 C?#5.1 C?#6.1 C?#7.1 C?#8.1 C?#9.1 C?#10.1 C?#11.1 C?#12.1 C?#13.1 C?#14.1 C?#15.1 D1.3(GND) D1.8(GND) D?#1.3(GND) D?#1.8(GND) D?#2.2(GND) D?#2.4(IO4) R?#1.1 R?#3.2 R?#4.1 R?#5.1 R?#7.2 U?#1.2(TMDS_Data_2_Shield) U?#1.5(TMDS_Data_1_Shield) U?#1.8(TMDS_Data_0_Shield) U?#1.11(TMDS_Clock_Shield) U?#1.16(SDA) U?#1.17(DDC/CEC_Ground) U?#2.30(CEC) U?#2.32(CEC_CLK) U?#2.34(DDCSDA) U?#2.65(EP)  [also labelled GND]
GND_HDMI: C?#1.1 R?#7.1 U?#1.20(GND) U?#1.21(GND) U?#1.22(GND) U?#1.23(GND)
VCC1P8: L?#1.1 L?#2.1 L?#3.1
VCC1P8_AVDD: C?#7.2 C?#8.2 C?#9.2 C?#10.2 L?#2.2 U?#2.15(AVDD) U?#2.19(AVDD) U?#2.25(AVDD)
VCC1P8_DVDD: C?#2.2 C?#3.2 C?#4.2 C?#5.2 C?#6.2 L?#1.2 U?#2.1(DVDD) U?#2.11(DVDD) U?#2.31(DVDD) U?#2.51(DVDD)
VCC1P8_PVDD: C?#11.2 C?#12.2 C?#13.2 L?#3.2 U?#2.12(PVDD) U?#2.13(BGVDD)
VCC3P3: L?#4.1 R?#6.1 R?#8.2 R?#9.2
VCC3P3_DVDD: C?#14.2 C?#15.2 L?#4.2 U?#2.29(DVDD_3V)
VCC5P5: D?#2.5(VCC) R?#2.2 R?#3.1 U?#1.18(+5V_Power)
DDCSCL: D?#2.3(IO2) R?#2.1 U?#1.15(SCL) U?#2.33(DDCSCL)
HDMI_HPD: D?#2.6(IO3) R?#5.2 U?#1.19(Hot_Plug_Detect) U?#2.16(HPD)
HDMI_I2C_SCL: R?#9.1 R?#11.1
HDMI_I2C_SDA: R?#8.1 R?#10.1
HDMI_I2S0: U?#2.5(I2S0)
HDMI_LRCLK: U?#2.10(LRCLK)
HDMI_MCLK: U?#2.4(MCLK)
HDMI_SCL: R?#11.2 U?#2.35(SCL)
HDMI_SCLK: U?#2.9(SCLK)
HDMI_SDA: R?#10.2 U?#2.36(SDA)
HDMI_TX_CLK: U?#2.53(CLK)
HDMI_TX_DE: U?#2.63(DE)
HDMI_TX_HS: U?#2.64(HSYNC)
HDMI_TX_INT: R?#6.2 U?#2.28(INT)
HDMI_TX_VS: U?#2.2(VSYNC)
TMDS_TX_n0: D1.5(IN) D1.6(NC) U?#1.9(TMDS_Data_0-) U?#2.20(TX0–)
TMDS_TX_n1: D?#1.4(IN) D?#1.7(NC) U?#1.6(TMDS_Data_1-) U?#2.23(TX1–)
TMDS_TX_n2: D1.2(IN) D1.9(NC) U?#1.3(TMDS_Data_2-) U?#2.26(TX2–)
TMDS_TX_nclk: D?#1.1(IN) D?#1.10(NC) U?#1.12(TMDS_Clock-) U?#2.17(TXC–)
TMDS_TX_p0: D1.4(IN) D1.7(NC) U?#1.7(TMDS_Data_0+) U?#2.21(TX0+)
TMDS_TX_p1: D?#1.5(IN) D?#1.6(NC) U?#1.4(TMDS_Data_1+) U?#2.24(TX1+)
TMDS_TX_p2: D1.1(IN) D1.10(NC) U?#1.1(TMDS_Data_2+) U?#2.27(TX2+)
TMDS_TX_pclk: D?#1.2(IN) D?#1.9(NC) U?#1.10(TMDS_Clock+) U?#2.18(TXC+)
NetR?#1_2: R?#1.2 U?#2.14(R_EXT)
NetR?#4_2: R?#4.2 U?#2.22(PD)

Not connected (* = marked no-connect by the designer): D?#2 1(IO1); U?#1 13(CEC)* 14(Utility); U?#2 3(SPDIF) 6(I2S1) 7(I2S2) 8(I2S3) 37(D23) 38(D22) 39(D21) 40(D20) 41(D19) 42(D18) 43(D17) 44(D16) 45(D15) 46(D14) 47(D13) 48(D12) 49(D11) 50(D10) 52(D9) 54(D8) 55(D7) 56(D6) 57(D5) 58(D4) 59(D3) 60(D2) 61(D1) 62(D0)

### Library data of the parts
C?#1 = 0402B104M160: Capacitor, Ceramic (MLCC), 100nF, ±20%, 16V, X7R, ±20%, SMD 0402; Manufacturer: Walsin Tech Corp; Package Size: 0402; JLCPCB Basic Part: No; JLCPCB Part Number: C163181; Supplier 1: LCSC; Category: Capacitors - MLCC; Supplier Part Number 1: C163181; Manufacturer Part Number: 0402B104M160; Tolerance: ±20%; Voltage Rating: 16V; Temperature Coefficient: X7R; RoHS: Yes; ComponentLink1Description: Datasheet; ComponentLink1URL: https://wmsc.lcsc.com/wmsc/upload/file/pdf/v2/lcsc/2304140030_Walsin-Tech-Corp-0402B104M160_C163181.pdf; ComponentLink2Description: JLCPCB Part URL; ComponentLink2URL: https://jlcpcb.com/partdetail/C163181; ComponentLink3Description: LCSC Part URL; ComponentLink3URL: https://lcsc.com/product-detail/Multilayer-Ceramic-Capacitors-MLCC---SMD-SMT_Walsin-Tech-Corp-Walsin-Tech-Corp-0402B104M160_C163181.html
C?#2 C?#7 C?#11 C?#14 = 04026D106MAT2A: Capacitor, Ceramic (MLCC), 10uF, ±20%, 6.3V, X5R, ±20%, SMD 0402; Manufacturer: Kyocera AVX; Package Size: 0402; JLCPCB Basic Part: No; JLCPCB Part Number: C2178725; Supplier 1: LCSC; Category: Capacitors - MLCC; Supplier Part Number 1: C2178725; Manufacturer Part Number: 04026D106MAT2A; Tolerance: ±20%; Voltage Rating: 6.3V; Temperature Coefficient: X5R; RoHS: Yes; ComponentLink1Description: Datasheet; ComponentLink1URL: https://wmsc.lcsc.com/wmsc/upload/file/pdf/v2/lcsc/2304140030_Kyocera-AVX-04026D106MAT2A_C2178725.pdf; ComponentLink2Description: JLCPCB Part URL; ComponentLink2URL: https://jlcpcb.com/partdetail/C2178725; ComponentLink3Description: LCSC Part URL; ComponentLink3URL: https://lcsc.com/product-detail/Multilayer-Ceramic-Capacitors-MLCC---SMD-SMT_Kyocera-AVX-Kyocera-AVX-04026D106MAT2A_C2178725.html
C?#3-C?#6 C?#8-C?#10 C?#12 C?#13 C?#15 = 02016D104KAT2A: Capacitor, Ceramic (MLCC), 0.1uF, ±10%, 6.3V, X5R, ±10%, SMD 0201; Manufacturer: Kyocera AVX; Package Size: 0201; JLCPCB Basic Part: No; JLCPCB Part Number: C5188607; Supplier 1: LCSC; Category: Capacitors - MLCC; Supplier Part Number 1: C5188607; Manufacturer Part Number: 02016D104KAT2A; Tolerance: ±10%; Voltage Rating: 6.3V; Temperature Coefficient: X5R; RoHS: Yes; ComponentLink1Description: Datasheet; ComponentLink1URL: https://wmsc.lcsc.com/wmsc/upload/file/pdf/v2/lcsc/2309151050_Kyocera-AVX-02016D104KAT2A_C5188607.pdf; ComponentLink2Description: JLCPCB Part URL; ComponentLink2URL: https://jlcpcb.com/partdetail/C5188607; ComponentLink3Description: LCSC Part URL; ComponentLink3URL: https://lcsc.com/product-detail/Multilayer-Ceramic-Capacitors-MLCC---SMD-SMT_Kyocera-AVX-Kyocera-AVX-02016D104KAT2A_C5188607.html
D1 D?#1 = RCLAMP0524P_C293965: Manufacturer: DOWO(东沃); Contributor: LCSC; Supplier: LCSC; Supplier Part: C293965; Manufacturer Part: RCLAMP0524P; JLCPCB Part Class: Extended Part; spicePre: D; spiceSymbolName: RCLAMP0524P_C293965
D?#2 = TPD4E001DBVR: Manufacturer: TI(德州仪器); Add into BOM: yes; Reverse Stand-Off Voltage (Vrwm): 5.5V; Peak Pulse Power Dissipation (Ppp)@10/1000us: 100W; Breakdown Voltage: 11V; Type: ESD; Symbol: TPD4E001DBVR; Device: TPD4E001DBVR; LCSC Part Name: TPD4E001DBVR; Supplier Part: C465736; Manufacturer Part: TPD4E001DBVR; Supplier Footprint: SOT-23-6; JLCPCB Part Class: Extended Part; Datasheet: https://www.ti.com/cn/lit/gpn/tpd4e001; Supplier: LCSC; Convert to PCB: yes; Maximum Clamping Voltage: -; Operating Temperature: -40℃~+85℃@(Ta)
L?#1-L?#4 = SDFL1608S100KTF: Inductor, 10uH, ±10%, 1.85Ω, 3mA, SMD 0603; Manufacturer: Sunlord; Self-Resonant Frequency: 2MHz; Q Factor: 30@2MHz; Package Size: 0603; JLCPCB Basic Part: Yes; JLCPCB Part Number: C1035; Supplier 1: LCSC; Category: Inductors; Supplier Part Number 1: C1035; Manufacturer Part Number: SDFL1608S100KTF; Tolerance: ±10%; Rated Current: 3mA; DC Resistance: 1.85Ω; RoHS: Yes; ComponentLink1Description: Datasheet; ComponentLink1URL: https://wmsc.lcsc.com/wmsc/upload/file/pdf/v2/lcsc/2310301641_Sunlord-SDFL1608S100KTF_C1035.pdf; ComponentLink2Description: JLCPCB Part URL; ComponentLink2URL: https://jlcpcb.com/partdetail/C1035; ComponentLink3Description: LCSC Part URL; ComponentLink3URL: https://lcsc.com/product-detail/Inductors-SMD_Sunlord-Sunlord-SDFL1608S100KTF_C1035.html
R?#1 = 0402WGF1001TCE: as R2 on sheet VGA; Supplier 1: LCSC; Manufacturer Part Number: 0402WGF1001TCE; Supplier Part Number 1: C11702; JLCPCB Part Number: C11702; Power Rating: 62.5mW; Category: Resistors; Package Size: 0402; JLCPCB Basic Part: Yes; Tolerance: ±1%; Voltage Rating: 50V; Temperature Coefficient: ±100ppm/℃; Temperature Rating: -55℃~+155℃; ComponentLink1Description: Datasheet; ComponentLink1URL: https://wmsc.lcsc.com/wmsc/upload/file/pdf/v2/lcsc/2206010216_UNI-ROYAL-Uniroyal-Elec-0402WGF1001TCE_C11702.pdf; ComponentLink2Description: JLCPCB Part URL; ComponentLink2URL: https://jlcpcb.com/partdetail/C11702
R?#2-R?#4 R?#6 = 0402WGF2001TCE: as R1 on sheet VGA; Supplier 1: LCSC; Manufacturer Part Number: 0402WGF2001TCE; Supplier Part Number 1: C4109; JLCPCB Part Number: C4109; Power Rating: 62.5mW; Category: Resistors; Package Size: 0402; JLCPCB Basic Part: Yes; Tolerance: ±1%; Voltage Rating: 50V; Temperature Coefficient: ±100ppm/℃; Temperature Rating: -55℃~+155℃; ComponentLink1Description: Datasheet; ComponentLink1URL: https://wmsc.lcsc.com/wmsc/upload/file/pdf/v2/lcsc/2206010230_UNI-ROYAL-Uniroyal-Elec-0402WGF2001TCE_C4109.pdf; ComponentLink2Description: JLCPCB Part URL; ComponentLink2URL: https://jlcpcb.com/partdetail/C4109
R?#5 = 0603WAF1002T5E: as R11 on sheet SWITCHES; Supplier 1: LCSC; Manufacturer Part Number: 0603WAF1002T5E; Supplier Part Number 1: C25804; JLCPCB Part Number: C25804; Power Rating: 100mW; Category: Resistors; Package Size: 0603; JLCPCB Basic Part: Yes; Tolerance: ±1%; Voltage Rating: 75V; Temperature Coefficient: ±100ppm/℃; Temperature Rating: -55℃~+155℃; ComponentLink1Description: Datasheet; ComponentLink1URL: https://wmsc.lcsc.com/wmsc/upload/file/pdf/v2/lcsc/2206010045_UNI-ROYAL-Uniroyal-Elec-0603WAF1002T5E_C25804.pdf; ComponentLink2Description: JLCPCB Part URL; ComponentLink2URL: https://jlcpcb.com/partdetail/C25804
R?#7 = 0402WGF1004TCE: Resistor, 1MΩ, ±1%, 62.5mW, 50V, ±100ppm/℃, -55℃~+155℃, SMD 0402; Manufacturer: Uniroyal; Supplier 1: LCSC; Manufacturer Part Number: 0402WGF1004TCE; Supplier Part Number 1: C26083; JLCPCB Part Number: C26083; Power Rating: 62.5mW; Category: Resistors; Package Size: 0402; JLCPCB Basic Part: Yes; Tolerance: ±1%; Voltage Rating: 50V; Temperature Coefficient: ±100ppm/℃; Temperature Rating: -55℃~+155℃; ComponentLink1Description: Datasheet; ComponentLink1URL: https://wmsc.lcsc.com/wmsc/upload/file/pdf/v2/lcsc/2206010030_UNI-ROYAL-Uniroyal-Elec-0402WGF1004TCE_C26083.pdf; ComponentLink2Description: JLCPCB Part URL; ComponentLink2URL: https://jlcpcb.com/partdetail/C26083
R?#8 R?#9 = 0402WGF4701TCE: Resistor, 4.7kΩ, ±1%, 62.5mW, 50V, ±100ppm/℃, -55℃~+155℃, SMD 0402; Manufacturer: Uniroyal; Supplier 1: LCSC; Manufacturer Part Number: 0402WGF4701TCE; Supplier Part Number 1: C25900; JLCPCB Part Number: C25900; Power Rating: 62.5mW; Category: Resistors; Package Size: 0402; JLCPCB Basic Part: Yes; Tolerance: ±1%; Voltage Rating: 50V; Temperature Coefficient: ±100ppm/℃; Temperature Rating: -55℃~+155℃; ComponentLink1Description: Datasheet; ComponentLink1URL: https://wmsc.lcsc.com/wmsc/upload/file/pdf/v2/lcsc/2206010045_UNI-ROYAL-Uniroyal-Elec-0402WGF4701TCE_C25900.pdf; ComponentLink2Description: JLCPCB Part URL; ComponentLink2URL: https://jlcpcb.com/partdetail/C25900
R?#10 R?#11 = 0402WGF220JTCE: Resistor, 22Ω, ±1%, 62.5mW, 50V, ±200ppm/℃, -55℃~+155℃, SMD 0402; Manufacturer: Uniroyal; Supplier 1: LCSC; Manufacturer Part Number: 0402WGF220JTCE; Supplier Part Number 1: C25092; JLCPCB Part Number: C25092; Power Rating: 62.5mW; Category: Resistors; Package Size: 0402; JLCPCB Basic Part: Yes; Tolerance: ±1%; Voltage Rating: 50V; Temperature Coefficient: ±200ppm/℃; Temperature Rating: -55℃~+155℃; ComponentLink1Description: Datasheet; ComponentLink1URL: https://wmsc.lcsc.com/wmsc/upload/file/pdf/v2/lcsc/2205311900_UNI-ROYAL-Uniroyal-Elec-0402WGF220JTCE_C25092.pdf; ComponentLink2Description: JLCPCB Part URL; ComponentLink2URL: https://jlcpcb.com/partdetail/C25092
U?#1 = HDMI-232D: Manufacturer: HANBO(汉博); Add into BOM: yes; Symbol: HDMI-232D; Device: HDMI-232D; LCSC Part Name: HDMI TYPE A型短体壳长9.5; Supplier Part: C47326463; Manufacturer Part: HDMI-232D; Supplier Footprint: SMD; JLCPCB Part Class: Extended Part; Datasheet: https://item.szlcsc.com/datasheet/HDMI-232D/49535968.html; Supplier: LCSC; Convert to PCB: yes
U?#2 = ADV7513BSWZ: Manufacturer: ADI(亚德诺); Add into BOM: yes; Control Interface: I2C; Voltage - Supply: 1.8V；3.3V; Symbol: ADV7513BSWZ; Device: ADV7513BSWZ; LCSC Part Name: ADV7513 HDMI 发送器; Supplier Part: C408901; Manufacturer Part: ADV7513BSWZ; Supplier Footprint: LQFP-64(10x10); JLCPCB Part Class: Extended Part; Datasheet: https://item.szlcsc.com/datasheet/ADV7513BSWZ/398368.html; Supplier: LCSC; Convert to PCB: yes; Type: -; Operating Temperature: -25℃~+85℃

## Nets that join several sheets
DDCSDA: VGA (5 pins), FPGA_GPIO (14 pins), MICROSD (7 pins), SWITCHES (24 pins), HDMI (36 pins)
VDD3.3: FPGA_GPIO (J1.15 J1.16), SWITCHES (22 pins)